# EAGLE design Soil_Sensor (EAGLE 4.16)
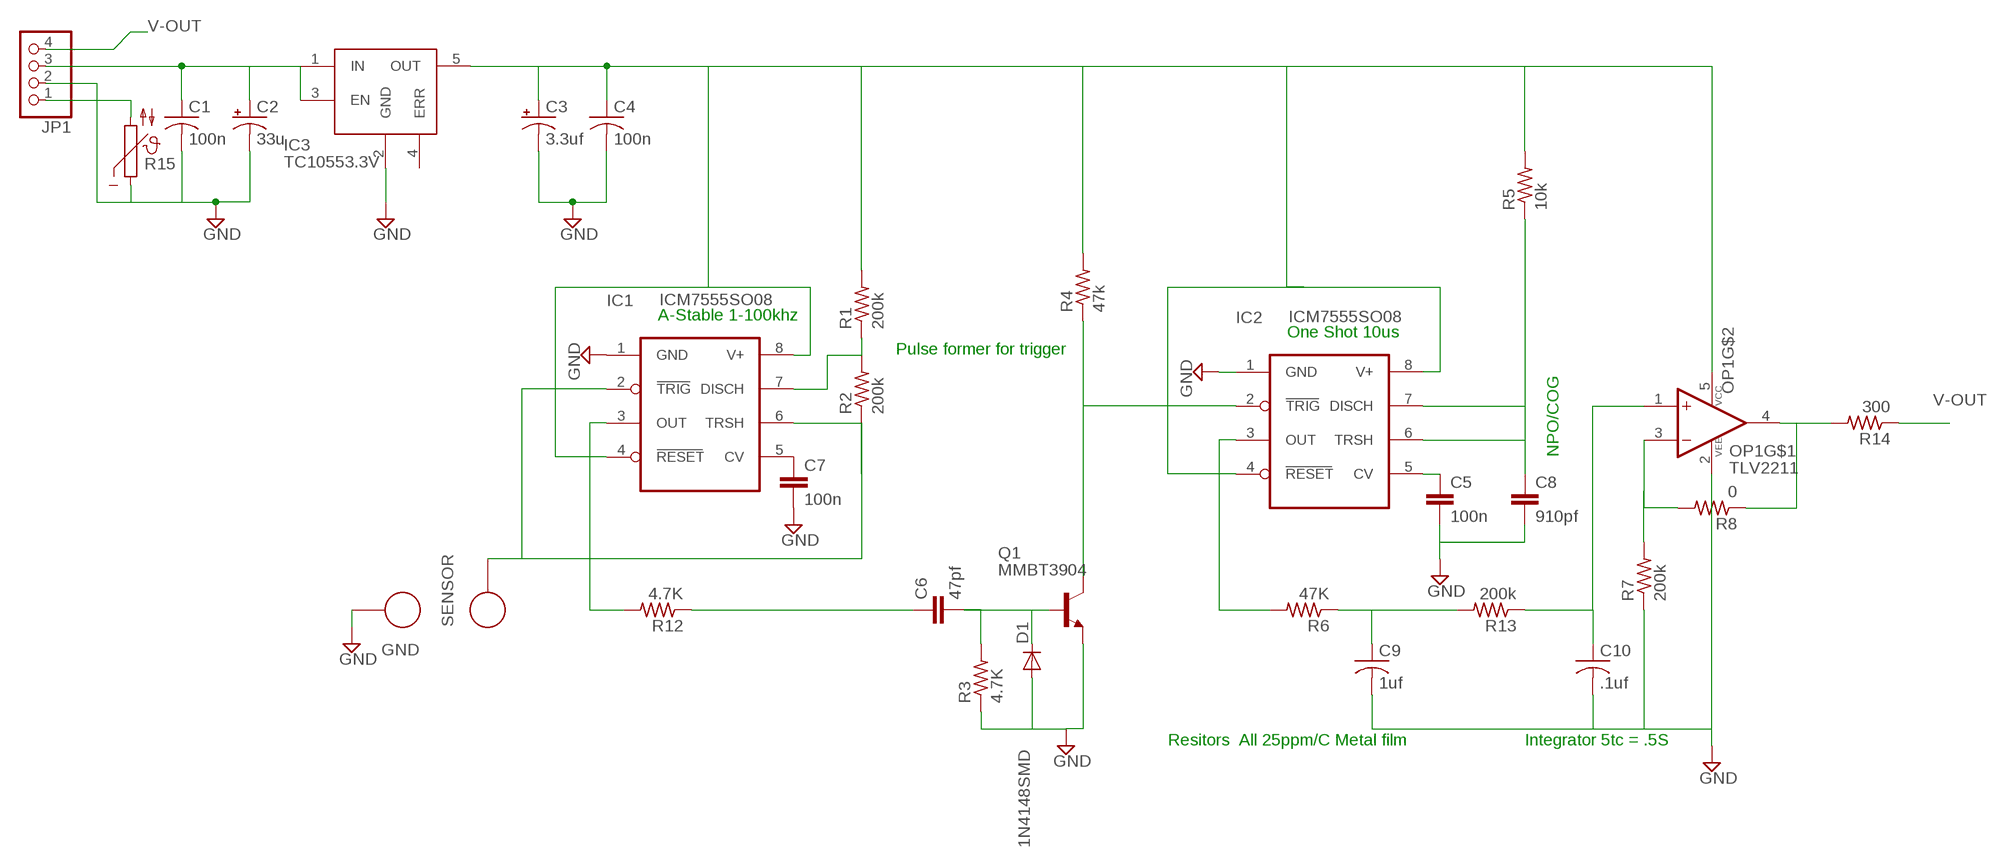
[diagram p0: schematic, sheet 1]

## Parts
C1  100n  C-USC0805  [C0805]
C2  33u  CPOL-USSMCD  [SMC_D]
C3  3.3uf  CPOL-USSMCD  [SMC_D]
C4  100n  C-USC0805  [C0805]
C5  100n  C-EUC0805  [C0805]
C6  47pf  C-EUC0603  [C0603]
C7  100n  C-EUC0805  [C0805]
C8  910pf  C-EUC0603  [C0603]
C9  1uf  C-USC0805  [C0805]
C10  .1uf  C-USC0805  [C0805]
D1  1N4148SMD  [SOD123]
GND  TP_1TPAD_300  [PAD_1]
IC1  ICM7555SO08  [SO08]
IC2  ICM7555SO08  [SO08]
IC3  TC10553.3V  [SOT23-5]
JP1  PINHD-1X4  [1X04]
OP1  TLV2211  [SOT23-5L]
Q1  MMBT3904  BC846BSMD  [SOT23]
R1  200k  R-US_R0603  [R0603]
R2  200k  R-US_R0603  [R0603]
R3  4.7K  R-US_R0603  [R0603]
R4  47k  R-US_R0603  [R0603]
R5  10k  R-US_R0603  [R0603]
R6  47K  R-US_R0603  [R0603]
R7  200k  R-US_R0603  [R0603]
R8  0  R-US_R0603  [R0603]
R12  4.7K  R-US_R0603  [R0603]
R13  200k  R-US_R0603  [R0603]
R14  300  R-US_R0603  [R0603]
R15  NTC640  [P640]
SENSOR  TP_1TPAD_300  [PAD_1]

## Nets
C_SEN: IC1.2(TRIG) IC1.6(TRSH) R2.1 SENSOR.P$1
GND: C1.2 C2.- C3.- C4.2 C5.2 C7.2 C8.2 C9.2 C10.2 D1.A GND.P$1 IC1.1(GND) IC2.1(GND) IC3.2(GND) JP1.2 OP1.2(VEE) Q1.2(E) R3.1 R7.1 R15.1
N$1: IC1.3(OUT) R12.2
N$2: IC2.2(TRIG) Q1.3(C) R4.1
N$3: C5.1 IC2.5(CV)
N$4: C8.1 IC2.6(TRSH) IC2.7(DISCH) R5.1
N$5: OP1.4(OUT) R8.1 R14.2
N$7: IC1.7(DISCH) R1.1 R2.2
N$8: C6.2 D1.C Q1.1(B) R3.2
N$9: C10.1 OP1.1(+IN) R13.1
N$10: C7.1 IC1.5(CV)
N$12: IC2.3(OUT) R6.2
N$13: OP1.3(-IN) R7.2 R8.2
N$14: C6.1 R12.1
N$15: C1.1 C2.+ IC3.1(IN) IC3.3(EN) JP1.3
N$16: JP1.1 R15.2
N$17: C9.1 R6.1 R13.2
V3_3V: C3.+ C4.1 IC1.4(RESET) IC1.8(V+) IC2.4(RESET) IC2.8(V+) IC3.5(OUT) OP1.5(VCC) R1.2 R4.2 R5.2
V-OUT: JP1.4 R14.1
Unconnected: IC3.4(ERR)

## Notes on the sheet
- A-Stable 1-100khz
- One Shot 10us
- Pulse former for trigger
- NPO/COG
- Resitors  All 25ppm/C Metal film | Integrator 5tc = .5S

## Library data of the parts
C1 C4 C9 C10 = rcl:C-US: CAPACITOR, American symbol
C2 C3 = rcl:CPOL-US: POLARIZED CAPACITOR, American symbol
C5-C8 = rcl:C-EU: CAPACITOR, European symbol
D1 = Stofer:1N4148: DIODE high speed (Philips)
GND SENSOR = Stofer:TP_1
IC1 IC2 = Stofer:ICM7555: TIMER
IC3 = Stofer:TC10553.3V
JP1 = Stofer:PINHD-1X4: PIN HEADER
OP1 = Stofer:TLV2211
Q1 = transistor-npn:BC846*: NPN Transistor
R1-R8 R12-R14 = rcl:R-US_: RESISTOR, American symbol
R15 = ptc-ntc:NTC640: PHILIPS NTC

## Board
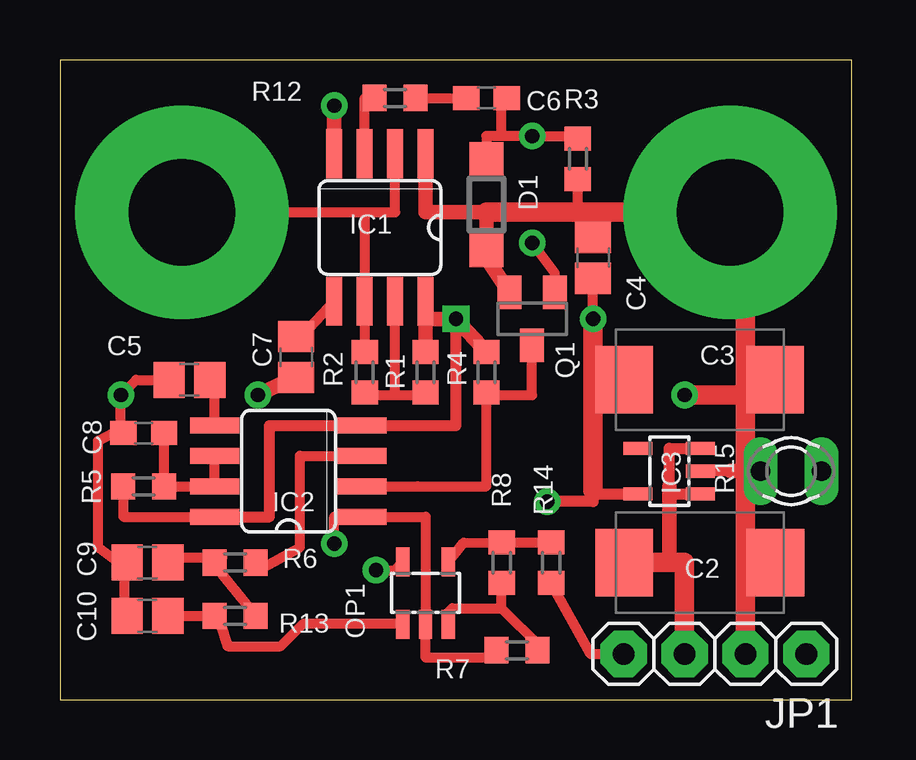
[diagram p1: board, top side]
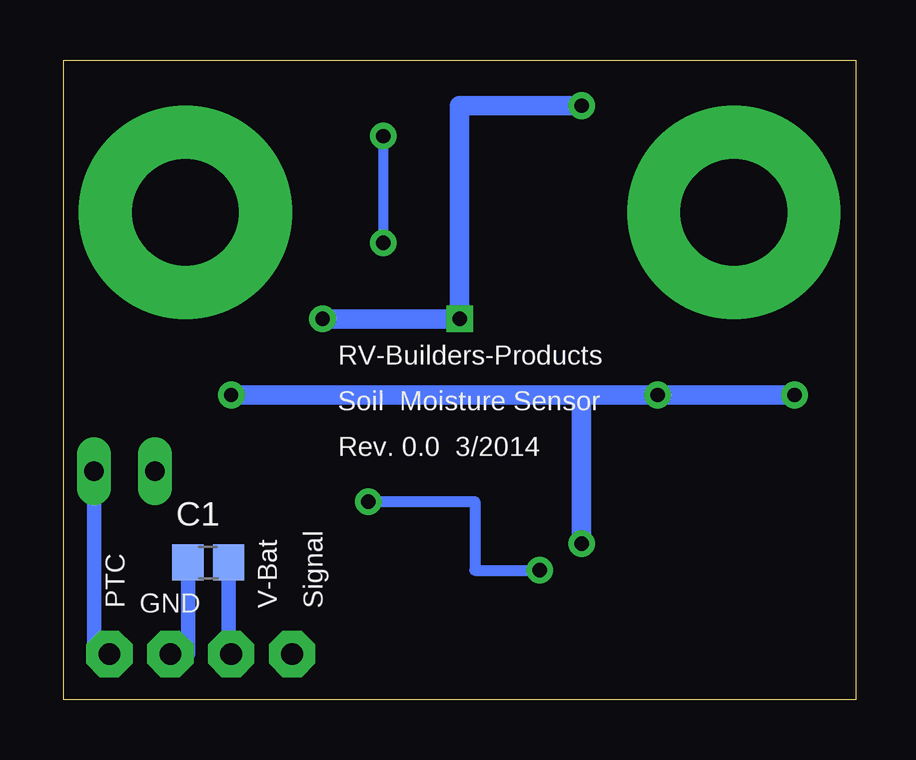
[diagram p2: board, bottom side, seen from below]

Size 33.02 x 26.67 mm. Coordinates in mm from the lower left corner, seen from the top.
Outline: 0,0 33.02,0 33.02,26.67 0,26.67 0,0
Copper layers (1*16): Top 0.035mm / dielectric 1.5mm / Bottom 0.035mm
Design rules "SparkFun": minimum track width 8mil, minimum drill 20mil, track to track 8mil, track to pad 8mil, pad to pad 8mil, via to via 8mil, smd to smd 8mil, copper to edge 10mil, drill to drill 8mil, minimum pad ring 12mil, minimum via ring 10mil, stop-mask expansion 4mil, vias tented up to drill 25mil, thermal gap 10mil

### Footprints (pad centres in the part's own frame; a part is rotated, then mirrored left to right if it is on the bottom)
C0805 = smd 1.3 x 1.5: 1 -0.85,0; 2 0.85,0
SMC_D = smd 2.4 x 2.8: + -3.15,0; - 3.15,0
C0603 = smd 1.1 x 1: 1 -0.85,0; 2 0.85,0
SOD123 = smd 1.4 x 1.4: A 1.9,0; C -1.9,0
PAD_1 = drill 4.445 pad 8.89 round: P$1 0,0
SO08 = smd 0.66 x 2.032: 1 -1.905,-3.073; 2 -0.635,-3.073; 3 0.635,-3.073; 4 1.905,-3.073; 5 1.905,3.073; 6 0.635,3.073; 7 -0.635,3.073; 8 -1.905,3.073
SOT23-5 = smd 0.55 x 1.2: 1 -0.95,-1.3; 2 0,-1.3; 3 0.95,-1.3; 4 0.95,1.3; 5 -0.95,1.3
1X04 = drill 0.9 pad 1.93 octagon: 1 -3.81,0; 2 -1.27,0; 3 1.27,0; 4 3.81,0
SOT23-5L = smd 0.55 x 1.2: 1 -0.95,-1.3; 2 0,-1.3; 3 0.95,-1.3; 4 0.95,1.3; 5 -0.95,1.3
SOT23 = smd 1 x 1.4: 1 -0.95,-1.1; 2 0.95,-1.1; 3 0,1.1
R0603 = smd 1 x 1.1: 1 -0.85,0; 2 0.85,0
P640 = drill 0.813 long: 1 -1.27,0; 2 1.27,0

### Placement (x,y rotation side)
C1  26.99,5.71 180 bottom
C2  26.67,5.71 0 top
C3  26.67,13.34 0 top
C4  22.23,18.41 90 top
C5  5.4,13.34 180 top
C6  17.78,25.08 0 top
C7  9.85,14.29 270 top
C8  3.49,11.11 180 top
C9  3.65,5.71 180 top
C10  3.65,3.49 180 top
D1  17.78,20.64 270 top
GND  27.94,20.32 0 top
IC1  13.34,19.68 180 top
IC2  9.53,9.53 90 top
IC3  25.4,9.53 90 top
JP1  27.3,1.91 180 top
OP1  15.24,4.45 0 top
Q1  19.68,15.88 180 top
R1  15.24,13.65 90 top
R2  12.7,13.65 270 top
R3  21.59,22.54 90 top
R4  17.78,13.65 90 top
R5  3.49,8.89 180 top
R6  7.3,5.71 0 top
R7  19.05,2.06 0 top
R8  18.41,5.71 270 top
R12  13.97,25.08 180 top
R13  7.3,3.49 0 top
R14  20.48,5.72 90 top
R15  30.48,9.53 0 top
SENSOR  5.08,20.32 0 top

### Tracks (layer width: path | path; a pad name or v marks a point on that pad's centre or on a via)
C_SEN
  Top 0.406: SENSOR.P$1 12.7,20.32 | 12.7,20.32 IC1.6 R2.1 | IC1.2 13.97,20.32 12.7,20.32
GND  (via drill 0.6)
  Top 0.406: C5.2 3.17,13.34 v2.54,12.7 2.54,11.11 C8.2 2.22,11.11 1.59,10.79 1.59,6.35 2.86,5.4 | C4.2 21.59,20.32 R3.1 | 2.86,3.17 C10.2 2.7,3.49 2.7,5.24 2.86,5.4 | 2.86,5.4 C9.2 | v11.43,6.51 11.43,7.62 IC2.1 15.24,7.62 15.24,3.17 | IC3.2 26.67,9.53 | R7.1 17.88,1.75 15.24,1.75 15.24,3.17 | 15.24,3.17 OP1.2
  Top 0.457: 27.94,9.53 IC3.2
  Top 0.61: IC1.1 15.24,20.32 17.78,20.32 D1.A 17.78,18.41 Q1.2 | C7.2 9.53,13.12 9.53,13.34 v8.26,12.7 | 28.57,9.53 27.94,9.53 R15.1 | 28.57,5.71 C2.-
  Top 0.813: v26.04,12.7 28.57,12.7 | 28.57,12.7 28.57,20.32 GND.P$1 21.59,20.32 17.78,20.32 | 28.57,12.7 28.57,9.53 28.57,5.71 JP1.2 | C3.- 29.18,12.7 28.57,12.7
  Bottom 0.61: C1.2 27.84,1.91 JP1.2
  Bottom 0.813: 11.43,12.7 v8.26,12.7 v2.54,12.7 | 11.43,12.7 v26.04,12.7 | 11.43,12.7 v11.43,6.51
N$1
  Top 0.406: R12.2 12.7,25.08 IC1.3
N$2
  Top 0.406: 17.78,12.7 19.68,12.7 Q1.3 | IC2.2 14.92,8.89 | 14.92,8.89 | 14.92,8.89 17.78,8.89 17.78,12.7 | 17.78,12.7 R4.1
N$3
  Top 0.406: C5.1 6.35,13.34 6.45,13.23 IC2.5
N$4
  Top 0.406: IC2.7 IC2.6 | IC2.7 6.35,8.89 | C8.1 R5.1 IC2.7
N$5
  Top 0.406: 16.19,5.87 OP1.4 16.83,6.54 R8.1 R14.2 | R14.2 | R14.2 | R14.2 20.48,6.51
N$7
  Top 0.406: R1.1 15.24,12.7 13.97,12.7 | R2.2 12.7,12.7 13.97,12.7 | 13.97,12.7 IC1.7
N$8  (via drill 0.6)
  Top 0.406: Q1.1 20.64,17.78 v19.68,19.05 | D1.C 17.78,23.5 18.41,23.5 | R3.2 21.59,23.5 v19.68,23.5 18.41,23.5 | C6.2 18.41,24.87 18.41,23.5
  Bottom 0.406: v19.68,19.05 v19.68,23.5
N$9
  Top 0.406: C10.1 R13.1 6.67,3.17 6.99,2.22 9.21,2.22 10.16,3.17 14.29,3.17 | 14.29,3.02 arc-90 14.29,3.02 | 14.29,3.17 OP1.1 | OP1.1 | OP1.1 14.29,2.86 14.29,3.02 | OP1.1 14.29,3.02 | 14.29,3.17 OP1.1
N$10
  Top 0.406: 10.16,15.24 10.16,15.14 C7.1 10.16,15.24 | 10.16,15.24 IC1.5
  Top 0.61: C7.1 10.16,15.45 10.16,15.24
N$12
  Top 0.406: IC2.3 10,10.16 10,6.35 8.26,5.4 R6.2
N$13
  Top 0.406: 18.41,3.81 R8.2 | 18.41,3.81 16.35,3.81 16.19,3.65 OP1.3 | R7.2 20,2.06 20,2.22 18.41,3.81
N$14
  Top 0.406: R12.1 C6.1
N$15
  Top 0.406: 25.4,8.89 25.4,8.57
  Top 0.457: IC3.3 25.4,10.47 25.4,8.89 | 25.4,8.57 IC3.1
  Top 0.61: C2.+ 24.13,5.71 25.4,5.71 25.4,8.89
  Top 0.813: 24.13,5.71 | JP1.3 26.04,5.71 24.13,5.71
  Bottom 0.61: C1.1 26.14,1.91 JP1.3
N$16
  Bottom 0.61: R15.2 31.75,1.91 JP1.1
N$17
  Top 0.406: C9.1 4.45,5.4 4.45,5.93 6.77,5.93 R6.1 6.35,5.71 R13.2
V3_3V  (via drill 0.6)
  Top 0.406: v22.23,15.88 C4.1 | R5.2 2.64,7.62 IC2.8 | 12.86,11.43 IC2.4 | 22.23,13.34 C3.+ | 22.23,8.57 22.23,8.73 | OP1.5 | OP1.5 14.29,5.4 | OP1.5 13.94,5.4 v13.18,5.4
  Top 0.457: v16.51,15.88 16.51,11.43 12.86,11.43 8.73,11.43 8.73,7.62 IC2.8 | 22.23,8.57 IC3.5 | v20.32,8.26 22.23,8.26 22.23,8.89
  Top 0.61: 15.24,15.88 IC1.8 | 15.24,15.88 R1.2 | R4.2 v16.51,15.88 15.24,15.88 | v11.43,24.77 IC1.4
  Top 0.813: 22.23,8.73 22.23,8.89 22.23,13.34 v22.23,15.88
  Bottom 0.457: v13.18,5.4 15.88,5.4 15.88,8.26 v20.32,8.26
  Bottom 0.813: v22.23,15.88 v16.51,15.88 16.51,24.77 v11.43,24.77
V-OUT
  Top 0.406: R14.1 22.12,1.91 JP1.4

### Text on the board
bPlace: RV-Builders-Products | Soil Moisture Sensor | Rev. 0.0 3/2014 | Signal | V-Bat | GND | PTC